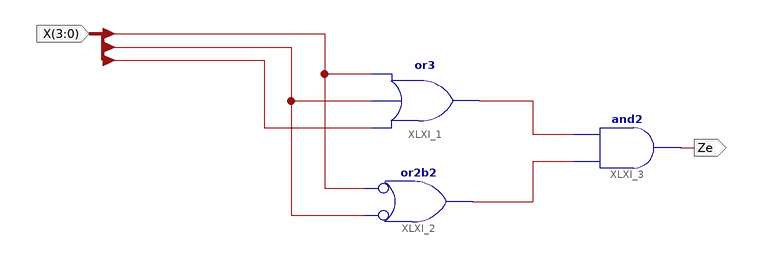
[diagram p0: schematic sheet 1]
// Xilinx ISE schematic e.sch (spartan3e) as structural Verilog: 3 symbols, 2 ports
module e (
  input  [3:0] X,
  output Ze
);

  wire XLXN_9, XLXN_10;

  or XLXI_1 (XLXN_9, X[3], X[2], X[1]);
  or XLXI_2 (XLXN_10, ~X[2], ~X[1]);  // or2b2
  and XLXI_3 (Ze, XLXN_10, XLXN_9);
endmodule
